# Altium schematic sheet power.SchDoc
size A4
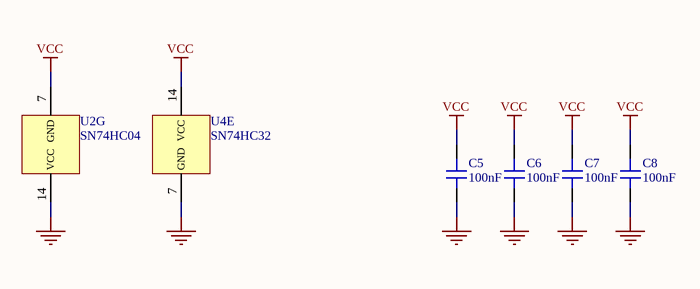
[diagram p0: power.SchDoc]

## Parts
C5  100nF  [DiskCapacitor]
C6  100nF  [DiskCapacitor]
C7  100nF  [DiskCapacitor]
C8  100nF  [DiskCapacitor]
U2  SN74HC04  [TSSOP14]  (part G of 7)
U4  SN74HC32  [CDIP14]  (part E of 5)

## Nets
GND: C5.1 C6.1 C7.1 C8.1 U2.14(VCC) U4.7(GND)
VCC: C5.2 C6.2 C7.2 C8.2 U2.7(GND) U4.14(VCC)

## Library data of the parts
C5-C8 = Capacitor
U2 = SN74HC04: Hex Inverters
U4 = SN74HC32: Quadruple 2-Input Positive-OR Gates